# EAGLE schematic fp2 (EAGLE 6.5.0)
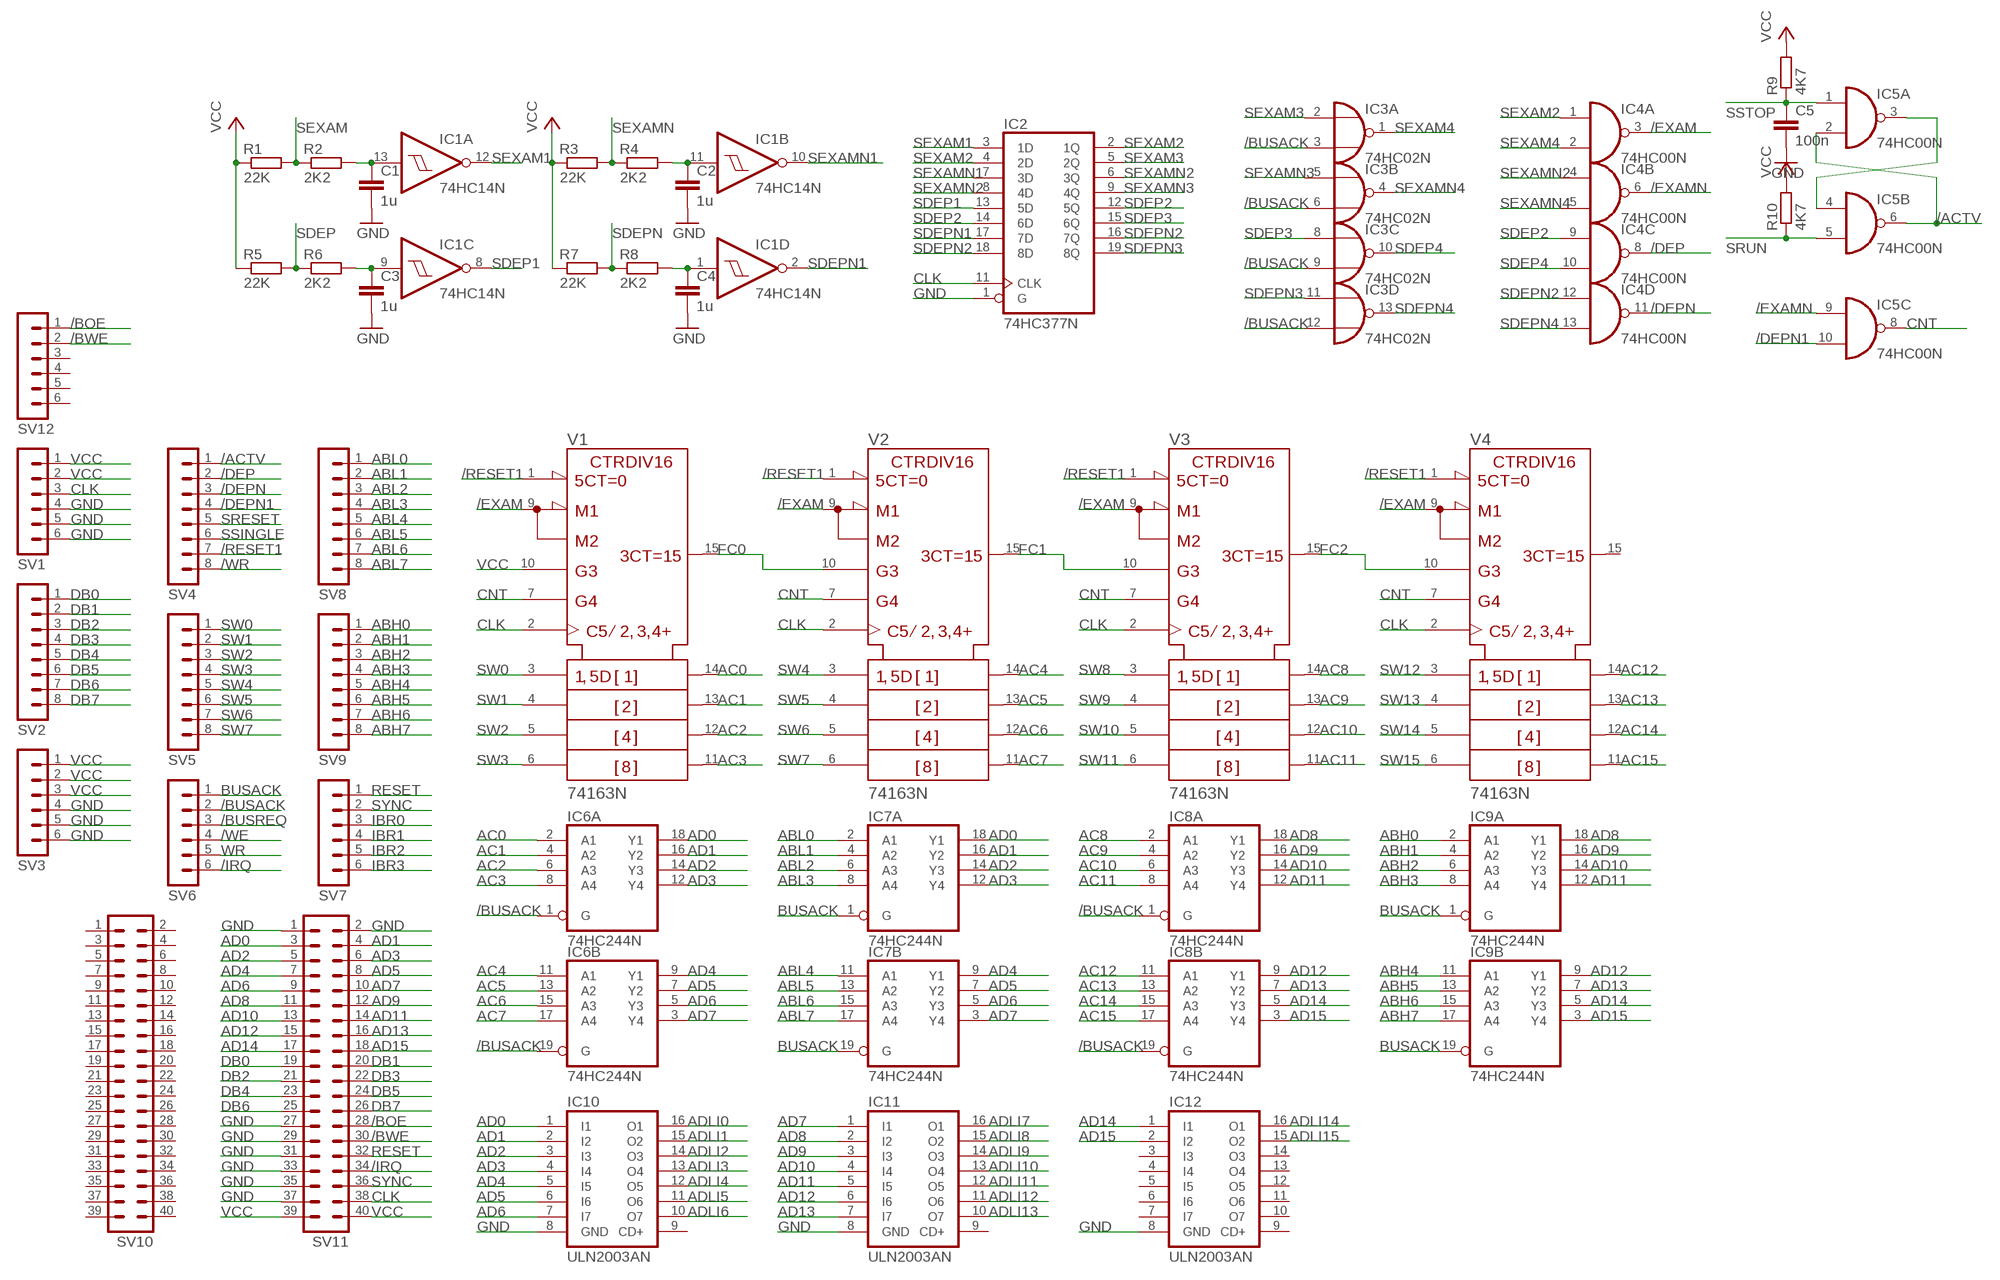
[diagram p0: schematic, sheet 1]

## Parts
C1  1u  C-EU025-024X044  [C025-024X044]
C2  1u  C-EU025-024X044  [C025-024X044]
C3  1u  C-EU025-024X044  [C025-024X044]
C4  1u  C-EU025-024X044  [C025-024X044]
C5  100n  C-EU025-024X044  [C025-024X044]
IC1  74HC14N  [DIL14]
IC2  74HC377N  [DIL20]
IC3  74HC02N  [DIL14]
IC4  74HC00N  [DIL14]
IC5  74HC00N  [DIL14]
IC6  74HC244N  [DIL20]
IC7  74HC244N  [DIL20]
IC8  74HC244N  [DIL20]
IC9  74HC244N  [DIL20]
IC10  ULN2003AN  [DIL16]
IC11  ULN2003AN  [DIL16]
IC12  ULN2003AN  [DIL16]
R1  22K  R-EU_0204/7  [0204/7]
R2  2K2  R-EU_0204/7  [0204/7]
R3  22K  R-EU_0204/7  [0204/7]
R4  2K2  R-EU_0204/7  [0204/7]
R5  22K  R-EU_0204/7  [0204/7]
R6  2K2  R-EU_0204/7  [0204/7]
R7  22K  R-EU_0204/7  [0204/7]
R8  2K2  R-EU_0204/7  [0204/7]
R9  4K7  R-EU_0204/7  [0204/7]
R10  4K7  R-EU_0204/7  [0204/7]
SV1  MA06-1  [MA06-1]
SV2  MA08-1  [MA08-1]
SV3  MA06-1  [MA06-1]
SV4  MA08-1  [MA08-1]
SV5  MA08-1  [MA08-1]
SV6  MA06-1  [MA06-1]
SV7  MA06-1  [MA06-1]
SV8  MA08-1  [MA08-1]
SV9  MA08-1  [MA08-1]
SV10  MA20-2  [MA20-2]
SV11  MA20-2  [MA20-2]
SV12  MA06-1  [MA06-1]
V1  74163N  [DIL16]
V2  74163N  [DIL16]
V3  74163N  [DIL16]
V4  74163N  [DIL16]

## Nets
/ACTV: IC5.2(A:I1) IC5.6(B:O) SV4.1
/BOE: SV11.28 SV12.1
/BUSACK: IC3.3(A:I1) IC3.6(B:I1) IC3.9(C:I1) IC3.12(D:I1) IC6.1(A:G) IC6.19(B:G) IC8.1(A:G) IC8.19(B:G) SV6.2
/BUSREQ: SV6.3
/BWE: SV11.30 SV12.2
/DEP: IC4.8(C:O) SV4.2
/DEPN: IC4.11(D:O) SV4.3
/DEPN1: IC5.10(C:I1) SV4.4
/EXAM: IC4.3(A:O) V1.9(!LOAD) V2.9(!LOAD) V3.9(!LOAD) V4.9(!LOAD)
/EXAMN: IC4.6(B:O) IC5.9(C:I0)
/IRQ: SV6.6 SV11.34
/RESET1: SV4.7 V1.1(!CLR) V2.1(!CLR) V3.1(!CLR) V4.1(!CLR)
/WE: SV6.4
/WR: SV4.8
ABH0: IC9.2(A:A1) SV9.1
ABH1: IC9.4(A:A2) SV9.2
ABH2: IC9.6(A:A3) SV9.3
ABH3: IC9.8(A:A4) SV9.4
ABH4: IC9.11(B:A1) SV9.5
ABH5: IC9.13(B:A2) SV9.6
ABH6: IC9.15(B:A3) SV9.7
ABH7: IC9.17(B:A4) SV9.8
ABL0: IC7.2(A:A1) SV8.1
ABL1: IC7.4(A:A2) SV8.2
ABL2: IC7.6(A:A3) SV8.3
ABL3: IC7.8(A:A4) SV8.4
ABL4: IC7.11(B:A1) SV8.5
ABL5: IC7.13(B:A2) SV8.6
ABL6: IC7.15(B:A3) SV8.7
ABL7: IC7.17(B:A4) SV8.8
AC0: IC6.2(A:A1) V1.14(QA)
AC1: IC6.4(A:A2) V1.13(QB)
AC2: IC6.6(A:A3) V1.12(QC)
AC3: IC6.8(A:A4) V1.11(QD)
AC4: IC6.11(B:A1) V2.14(QA)
AC5: IC6.13(B:A2) V2.13(QB)
AC6: IC6.15(B:A3) V2.12(QC)
AC7: IC6.17(B:A4) V2.11(QD)
AC8: IC8.2(A:A1) V3.14(QA)
AC9: IC8.4(A:A2) V3.13(QB)
AC10: IC8.6(A:A3) V3.12(QC)
AC11: IC8.8(A:A4) V3.11(QD)
AC12: IC8.11(B:A1) V4.14(QA)
AC13: IC8.13(B:A2) V4.13(QB)
AC14: IC8.15(B:A3) V4.12(QC)
AC15: IC8.17(B:A4) V4.11(QD)
ACTV: IC5.3(A:O) IC5.4(B:I0)
AD0: IC6.18(A:Y1) IC7.18(A:Y1) IC10.1(I1) SV11.3
AD1: IC6.16(A:Y2) IC7.16(A:Y2) IC10.2(I2) SV11.4
AD2: IC6.14(A:Y3) IC7.14(A:Y3) IC10.3(I3) SV11.5
AD3: IC6.12(A:Y4) IC7.12(A:Y4) IC10.4(I4) SV11.6
AD4: IC6.9(B:Y1) IC7.9(B:Y1) IC10.5(I5) SV11.7
AD5: IC6.7(B:Y2) IC7.7(B:Y2) IC10.6(I6) SV11.8
AD6: IC6.5(B:Y3) IC7.5(B:Y3) IC10.7(I7) SV11.9
AD7: IC6.3(B:Y4) IC7.3(B:Y4) IC11.1(I1) SV11.10
AD8: IC8.18(A:Y1) IC9.18(A:Y1) IC11.2(I2) SV11.11
AD9: IC8.16(A:Y2) IC9.16(A:Y2) IC11.3(I3) SV11.12
AD10: IC8.14(A:Y3) IC9.14(A:Y3) IC11.4(I4) SV11.13
AD11: IC8.12(A:Y4) IC9.12(A:Y4) IC11.5(I5) SV11.14
AD12: IC8.9(B:Y1) IC9.9(B:Y1) IC11.6(I6) SV11.15
AD13: IC8.7(B:Y2) IC9.7(B:Y2) IC11.7(I7) SV11.16
AD14: IC8.5(B:Y3) IC9.5(B:Y3) IC12.1(I1) SV11.17
AD15: IC8.3(B:Y4) IC9.3(B:Y4) IC12.2(I2) SV11.18
ADLI0: IC10.16(O1)
ADLI1: IC10.15(O2)
ADLI2: IC10.14(O3)
ADLI3: IC10.13(O4)
ADLI4: IC10.12(O5)
ADLI5: IC10.11(O6)
ADLI6: IC10.10(O7)
ADLI7: IC11.16(O1)
ADLI8: IC11.15(O2)
ADLI9: IC11.14(O3)
ADLI10: IC11.13(O4)
ADLI11: IC11.12(O5)
ADLI12: IC11.11(O6)
ADLI13: IC11.10(O7)
ADLI14: IC12.16(O1)
ADLI15: IC12.15(O2)
BUSACK: IC7.1(A:G) IC7.19(B:G) IC9.1(A:G) IC9.19(B:G) SV6.1
CLK: IC2.11(CLK) SV1.3 SV11.38 V1.2(CLK) V2.2(CLK) V3.2(CLK) V4.2(CLK)
CNT: IC5.8(C:O) V1.7(ENP) V2.7(ENP) V3.7(ENP) V4.7(ENP)
DB0: SV2.1 SV11.19
DB1: SV2.2 SV11.20
DB2: SV2.3 SV11.21
DB3: SV2.4 SV11.22
DB4: SV2.5 SV11.23
DB5: SV2.6 SV11.24
DB6: SV2.7 SV11.25
DB7: SV2.8 SV11.26
FC0: V1.15(RCO) V2.10(ENT)
FC1: V2.15(RCO) V3.10(ENT)
FC2: V3.15(RCO) V4.10(ENT)
GND: C1.2 C2.2 C3.2 C4.2 C5.2 IC2.1(G) IC10.8(GND) IC11.8(GND) IC12.8(GND) SV1.4 SV1.5 SV1.6 SV3.4 SV3.5 SV3.6 SV11.1 SV11.2 SV11.27 SV11.29 SV11.31 SV11.33 SV11.35 SV11.37
IBR0: SV7.3
IBR1: SV7.4
IBR2: SV7.5
IBR3: SV7.6
RESET: SV7.1 SV11.32
SDEP: R5.2 R6.1
SDEP0: C3.1 IC1.9(C:I) R6.2
SDEP1: IC1.8(C:O) IC2.13(5D)
SDEP2: IC2.12(5Q) IC2.14(6D) IC4.9(C:I0)
SDEP3: IC2.15(6Q) IC3.8(C:I0)
SDEP4: IC3.10(C:O) IC4.10(C:I1)
SDEPN: R7.2 R8.1
SDEPN0: C4.1 IC1.1(D:I) R8.2
SDEPN1: IC1.2(D:O) IC2.17(7D)
SDEPN2: IC2.16(7Q) IC2.18(8D) IC4.12(D:I0)
SDEPN3: IC2.19(8Q) IC3.11(D:I0)
SDEPN4: IC3.13(D:O) IC4.13(D:I1)
SEXAM: R1.2 R2.1
SEXAM0: C1.1 IC1.13(A:I) R2.2
SEXAM1: IC1.12(A:O) IC2.3(1D)
SEXAM2: IC2.2(1Q) IC2.4(2D) IC4.1(A:I0)
SEXAM3: IC2.5(2Q) IC3.2(A:I0)
SEXAM4: IC3.1(A:O) IC4.2(A:I1)
SEXAMN: R3.2 R4.1
SEXAMN0: C2.1 IC1.11(B:I) R4.2
SEXAMN1: IC1.10(B:O) IC2.7(3D)
SEXAMN2: IC2.6(3Q) IC2.8(4D) IC4.4(B:I0)
SEXAMN3: IC2.9(4Q) IC3.5(B:I0)
SEXAMN4: IC3.4(B:O) IC4.5(B:I1)
SRESET: SV4.5
SRUN: IC5.5(B:I1) R10.1
SSINGLE: SV4.6
SSTOP: C5.1 IC5.1(A:I0) R9.1
SW0: SV5.1 V1.3(A)
SW1: SV5.2 V1.4(B)
SW2: SV5.3 V1.5(C)
SW3: SV5.4 V1.6(D)
SW4: SV5.5 V2.3(A)
SW5: SV5.6 V2.4(B)
SW6: SV5.7 V2.5(C)
SW7: SV5.8 V2.6(D)
SW8: V3.3(A)
SW9: V3.4(B)
SW10: V3.5(C)
SW11: V3.6(D)
SW12: V4.3(A)
SW13: V4.4(B)
SW14: V4.5(C)
SW15: V4.6(D)
SYNC: SV7.2 SV11.36
VCC: R1.1 R3.1 R5.1 R7.1 R9.2 R10.2 SV1.1 SV1.2 SV3.1 SV3.2 SV3.3 SV11.39 SV11.40 V1.10(ENT)
WR: SV6.5
Unconnected: IC1.3(E:I) IC1.4(E:O) IC1.5(F:I) IC1.6(F:O) IC5.11(D:O) IC5.12(D:I0) IC5.13(D:I1) IC10.9(CD+) IC11.9(CD+) IC12.3(I3) IC12.4(I4) IC12.5(I5) IC12.6(I6) IC12.7(I7) IC12.9(CD+) IC12.10(O7) IC12.11(O6) IC12.12(O5) IC12.13(O4) IC12.14(O3) SV10.1 SV10.2 SV10.3 SV10.4 SV10.5 SV10.6 SV10.7 SV10.8 SV10.9 SV10.10 SV10.11 SV10.12 SV10.13 SV10.14 SV10.15 SV10.16 SV10.17 SV10.18 SV10.19 SV10.20 SV10.21 SV10.22 SV10.23 SV10.24 SV10.25 SV10.26 SV10.27 SV10.28 SV10.29 SV10.30 SV10.31 SV10.32 SV10.33 SV10.34 SV10.35 SV10.36 SV10.37 SV10.38 SV10.39 SV10.40 SV12.3 SV12.4 SV12.5 SV12.6 V4.15(RCO)

## Power pins joined to a net without a drawn wire
+UB: V1.16(+UB) V2.16(+UB) V3.16(+UB) V4.16(+UB)
-UB: V1.8(-UB) V2.8(-UB) V3.8(-UB) V4.8(-UB)
GND: IC1.7(P:GND) IC2.10(GND) IC3.7(P:GND) IC4.7(P:GND) IC5.7(P:GND) IC6.10(P:GND) IC7.10(P:GND) IC8.10(P:GND) IC9.10(P:GND)
VCC: IC1.14(P:VCC) IC2.20(VCC) IC3.14(P:VCC) IC4.14(P:VCC) IC5.14(P:VCC) IC6.20(P:VCC) IC7.20(P:VCC) IC8.20(P:VCC) IC9.20(P:VCC)

## Library data of the parts
C1-C5 = rcl:C-EU: CAPACITOR, European symbol
IC1 = 74xx-eu:74*14: Hex schmitt trigger INVERTER
IC2 = 74xx-eu:74*377: Octal D type FLIP FLOP, enable
IC3 = 74xx-eu:74*02: Quad 2-input NOR gate
IC4 IC5 = 74xx-eu:74*00: Quad 2-input NAND gate
IC6-IC9 = 74xx-eu:74*244: Octal BUFFER and LINE DRIVER, 3-state
IC10-IC12 = uln-udn:ULN2003A: DRIVER ARRAY
R1-R10 = rcl:R-EU_: RESISTOR, European symbol
SV1 SV3 SV6 SV7 SV12 = con-lstb:MA06-1: PIN HEADER; OC_FARNELL: unknown; OC_NEWARK: unknown
SV2 SV4 SV5 SV8 SV9 = con-lstb:MA08-1: PIN HEADER; OC_FARNELL: unknown; OC_NEWARK: unknown
SV10 SV11 = con-lstb:MA20-2: PIN HEADER; OC_FARNELL: unknown; OC_NEWARK: unknown
V1-V4 = 74ttl-din:74*163: Synchrounus 4-bit COUNTER